# EAGLE schematic Baboi_v1.1 (EAGLE 6.4)

## Sheet 1 of 2
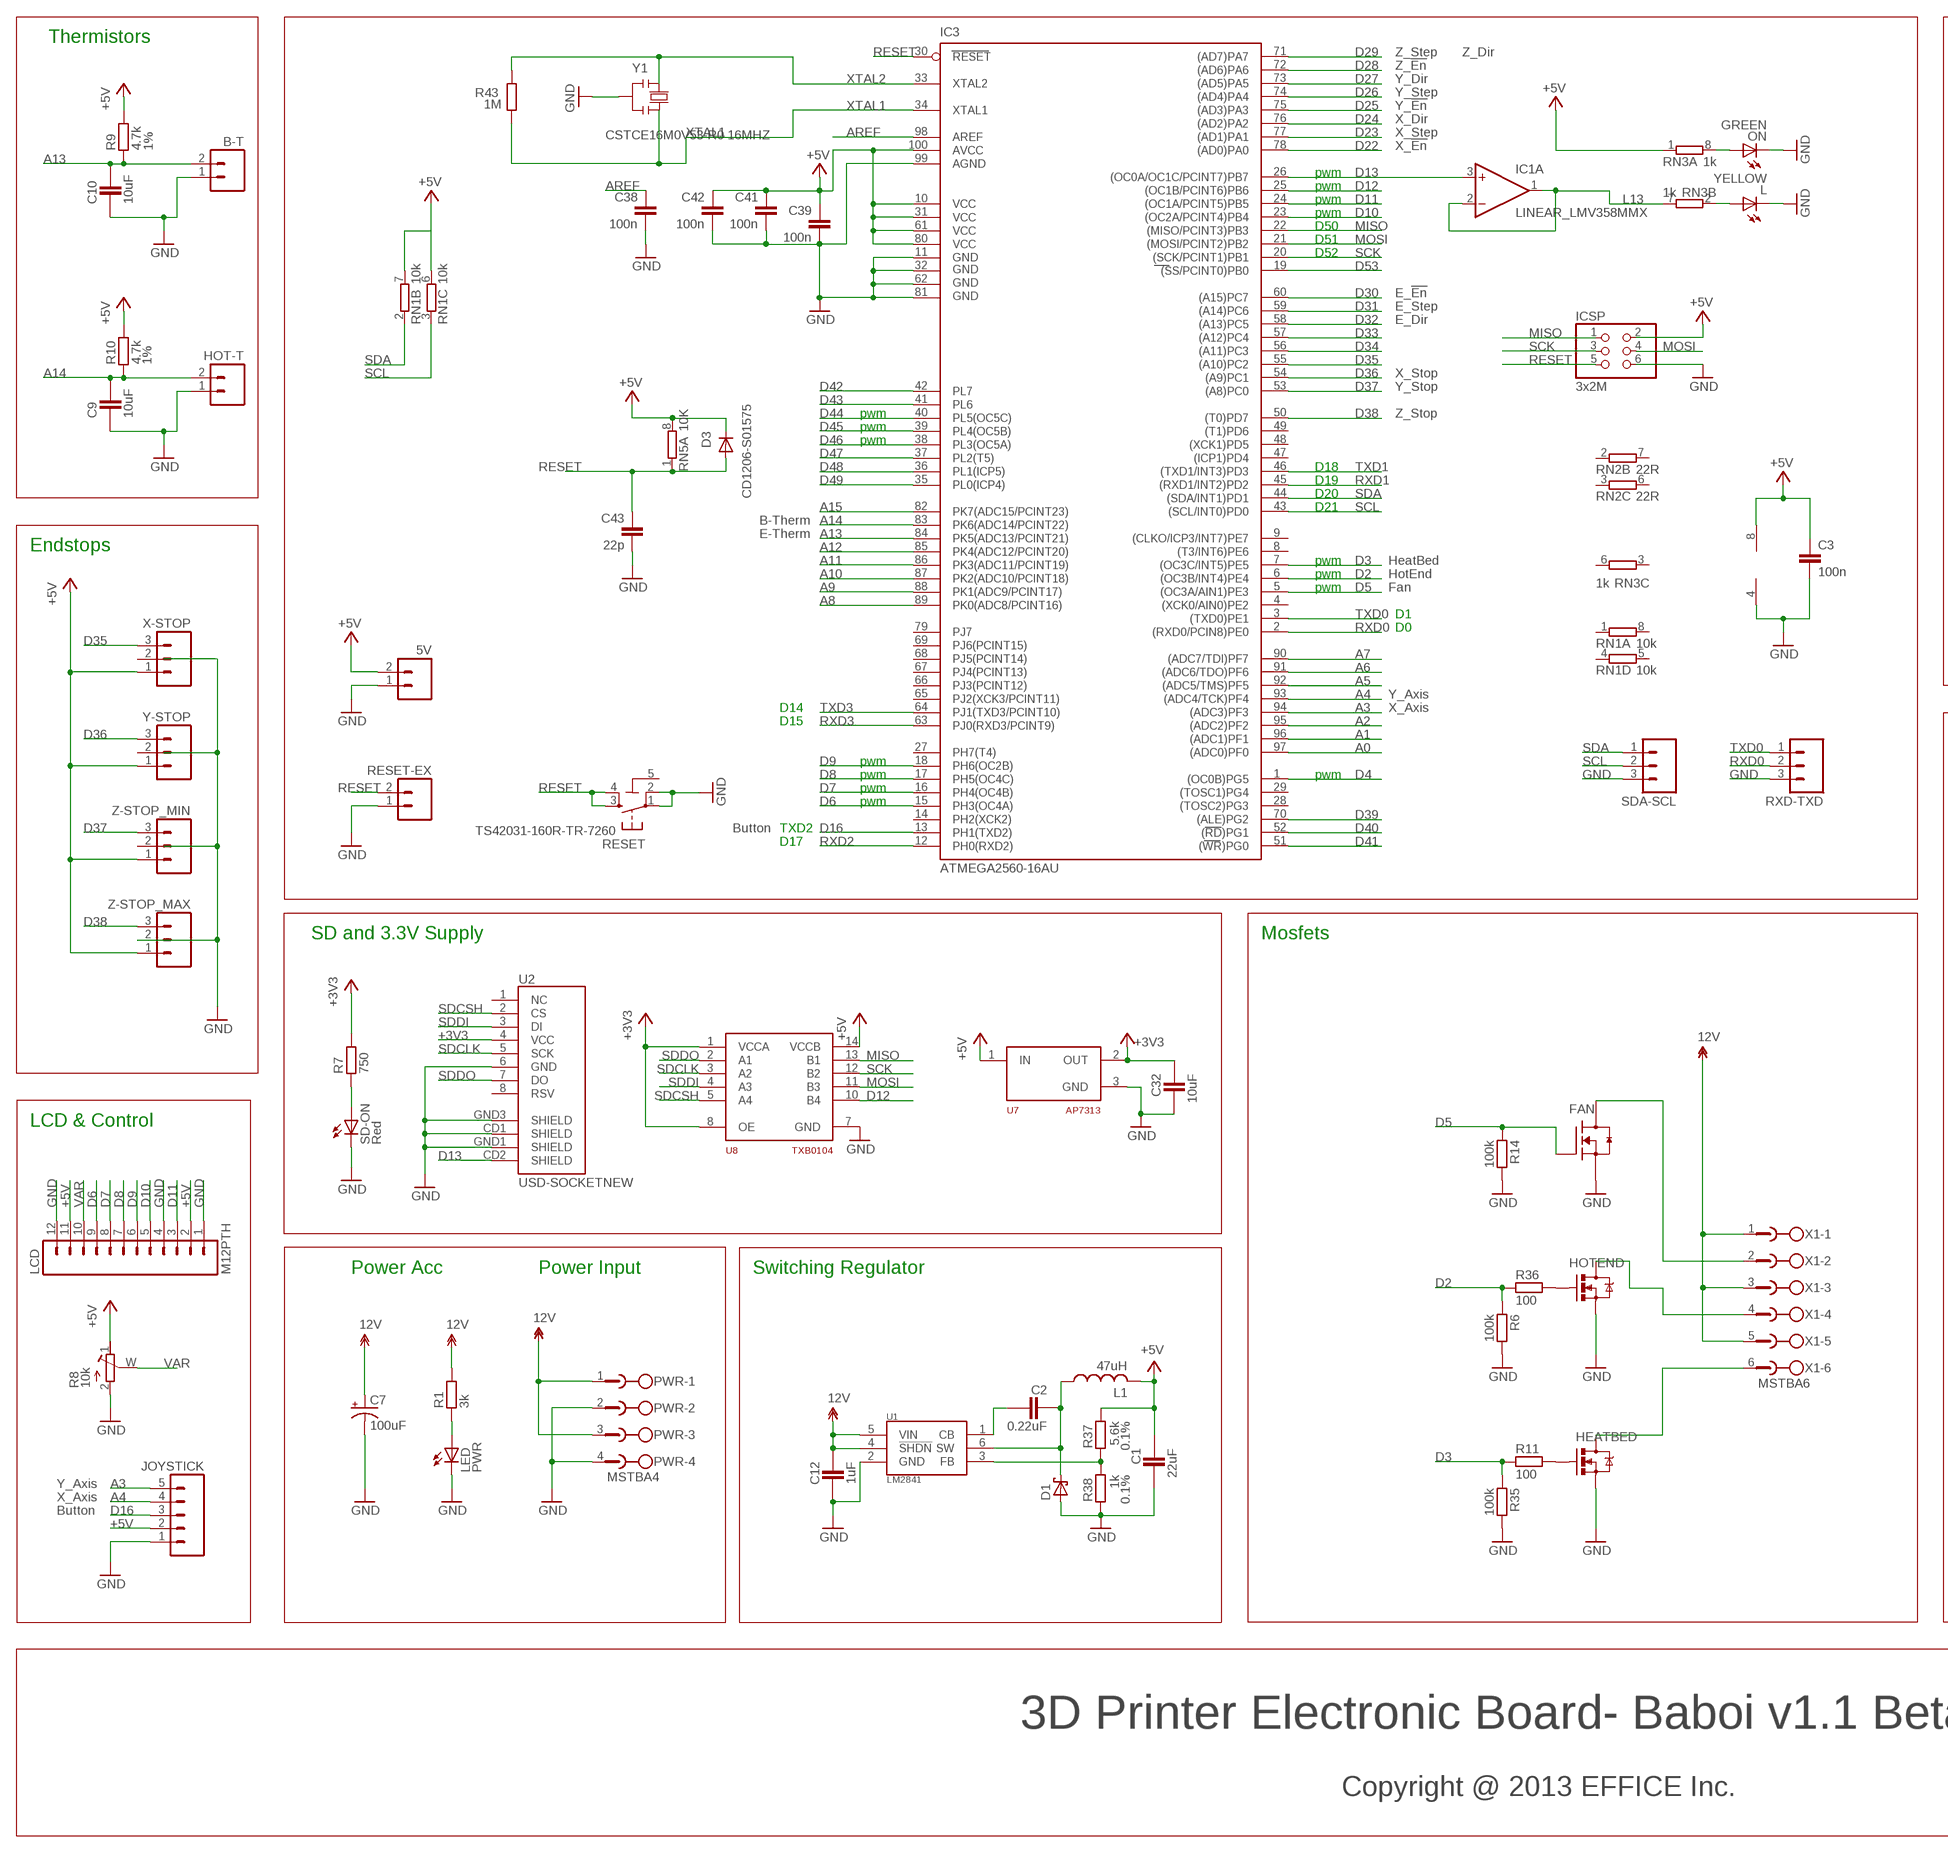
[diagram p0: schematic, sheet 1, part 1 of 2]
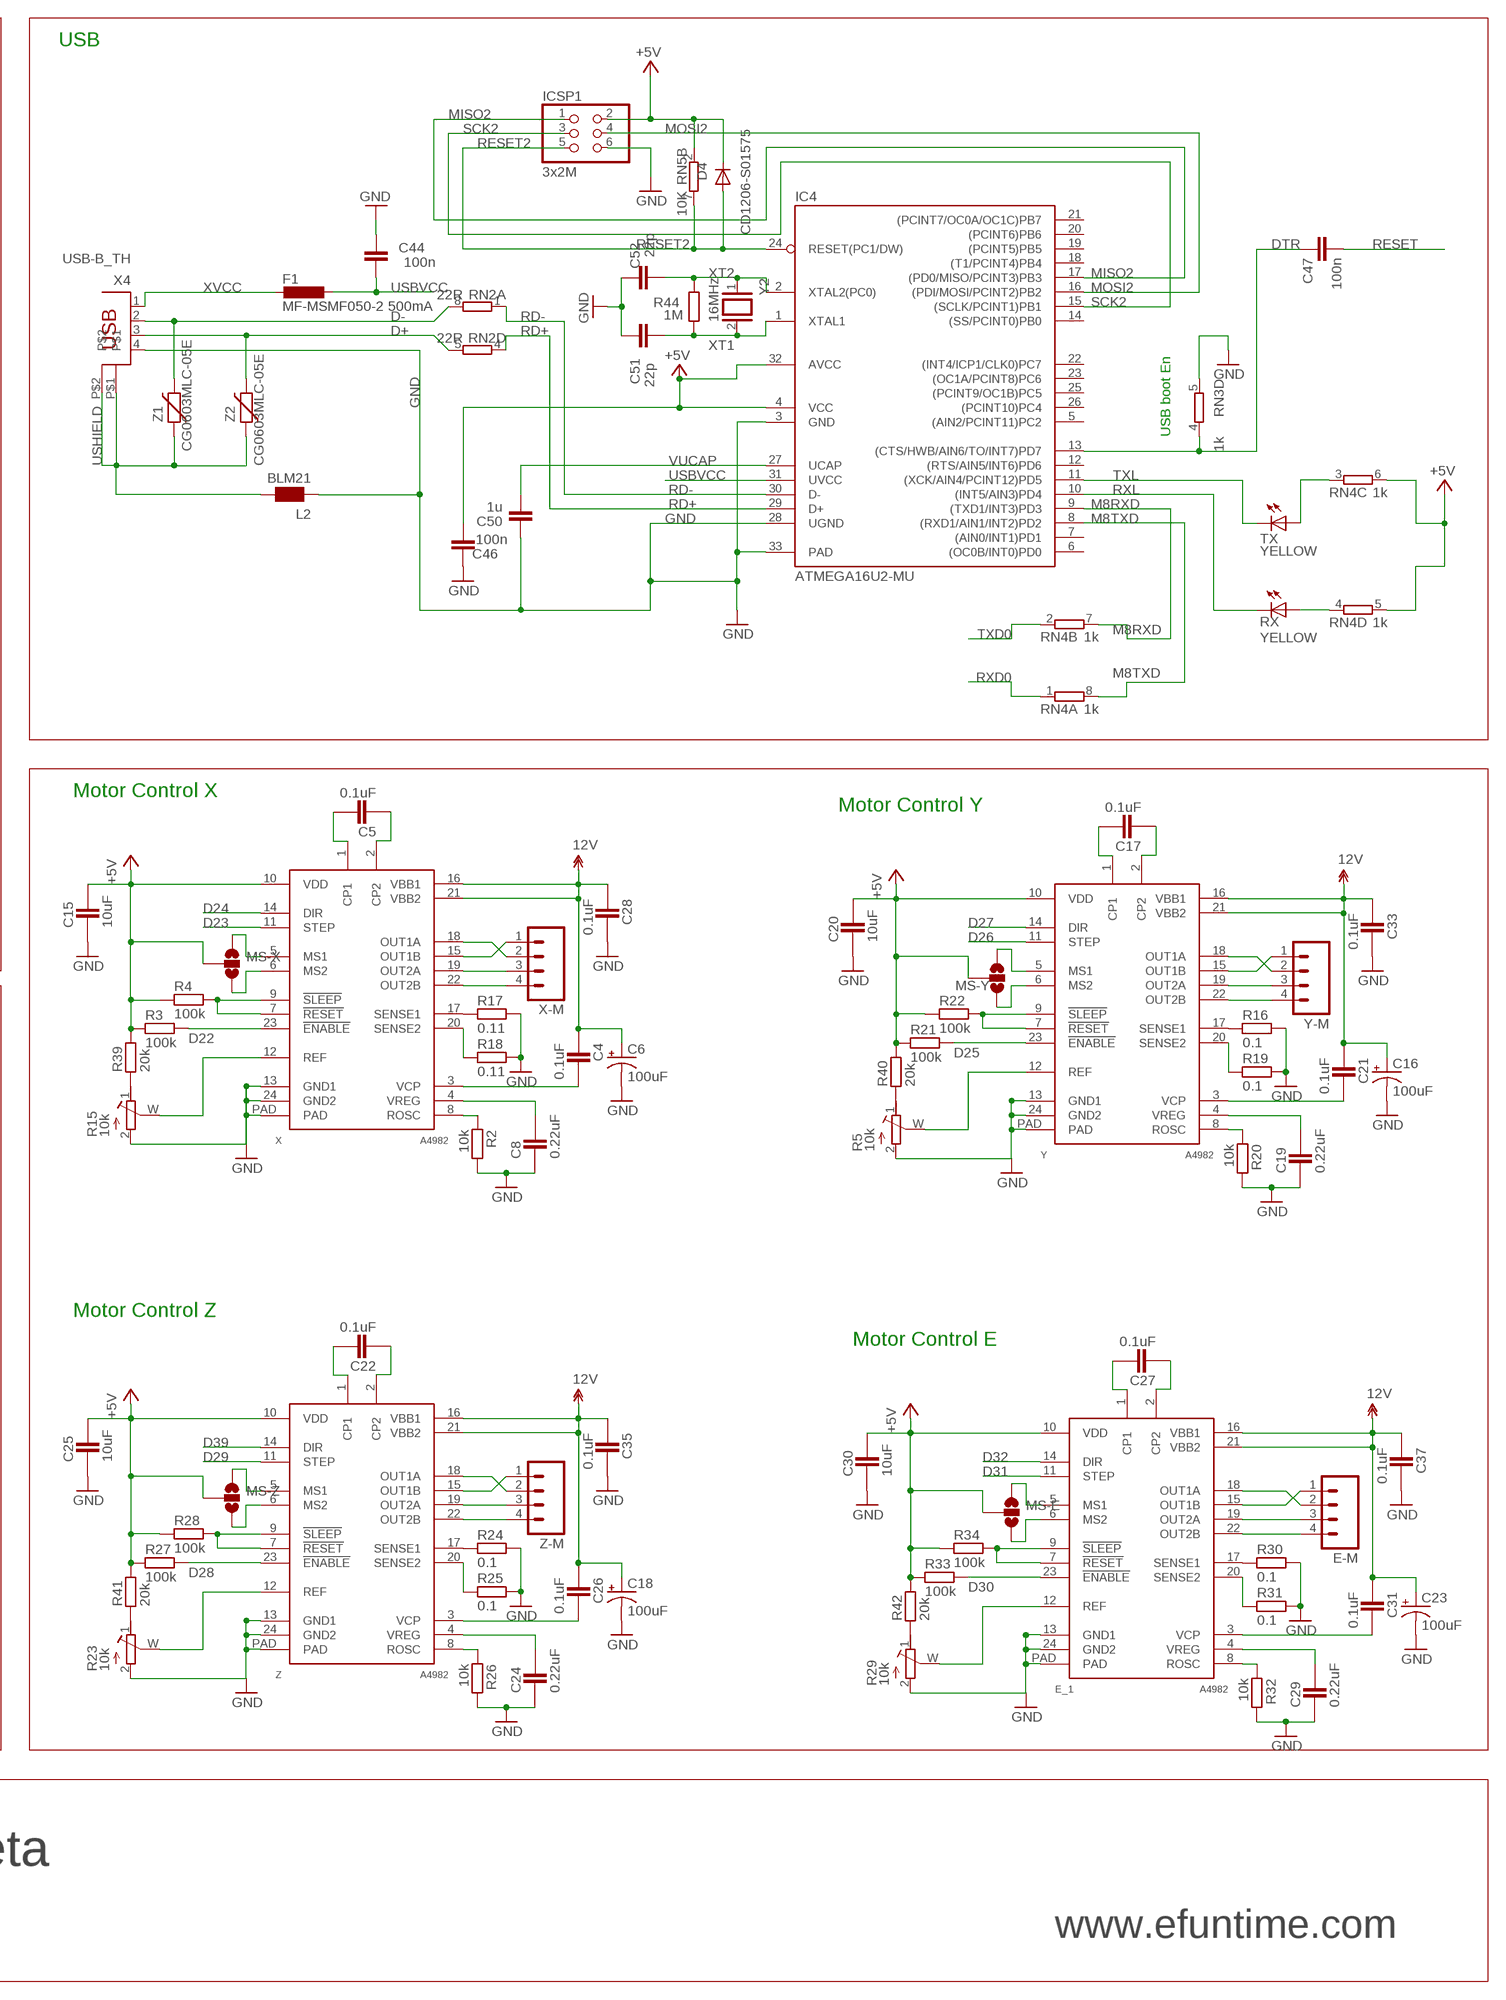
[diagram p1: schematic, sheet 1, part 2 of 2]

### Parts
5V  M02PTH  [1X02]
B-T  M02PTH  [1X02]
C1  22uF  CAPACITOR_0805  [CAPC2012X145AN]
C2  0.22uF  CAPACITOR_0805  [CAPC2012X145AN]
C3  100n  SMARTPRJ_C-EUC0603  [SMARTPRJ_C0603-ROUND]
C4  0.1uF  CAPACITOR_0805  [CAPC2012X145AN]
C5  0.1uF  CAPACITOR_0805  [CAPC2012X145AN]
C6  100uF  CPOL-USD  [PANASONIC_D]
C7  100uF  CPOL-USD  [PANASONIC_D]
C8  0.22uF  CAPACITOR_0805  [CAPC2012X145AN]
C9  10uF  CAPACITOR_0805  [CAPC2012X145AN]
C10  10uF  CAPACITOR_0805  [CAPC2012X145AN]
C12  1uF  CAPACITOR_0805  [CAPC2012X145AN]
C15  10uF  CAPACITOR_0805  [CAPC2012X145AN]
C16  100uF  CPOL-USD  [PANASONIC_D]
C17  0.1uF  CAPACITOR_0805  [CAPC2012X145AN]
C18  100uF  CPOL-USD  [PANASONIC_D]
C19  0.22uF  CAPACITOR_0805  [CAPC2012X145AN]
C20  10uF  CAPACITOR_0805  [CAPC2012X145AN]
C21  0.1uF  CAPACITOR_0805  [CAPC2012X145AN]
C22  0.1uF  CAPACITOR_0805  [CAPC2012X145AN]
C23  100uF  CPOL-USD  [PANASONIC_D]
C24  0.22uF  CAPACITOR_0805  [CAPC2012X145AN]
C25  10uF  CAPACITOR_0805  [CAPC2012X145AN]
C26  0.1uF  CAPACITOR_0805  [CAPC2012X145AN]
C27  0.1uF  CAPACITOR_0805  [CAPC2012X145AN]
C28  0.1uF  CAPACITOR_0805  [CAPC2012X145AN]
C29  0.22uF  CAPACITOR_0805  [CAPC2012X145AN]
C30  10uF  CAPACITOR_0805  [CAPC2012X145AN]
C31  0.1uF  CAPACITOR_0805  [CAPC2012X145AN]
C32  10uF  CAPACITOR_0805  [CAPC2012X145AN]
C33  0.1uF  CAPACITOR_0805  [CAPC2012X145AN]
C35  0.1uF  CAPACITOR_0805  [CAPC2012X145AN]
C37  0.1uF  CAPACITOR_0805  [CAPC2012X145AN]
C38  100n  C-EU0603-RND  [C0603-ROUND]
C39  100n  C-EU0603-RND  [C0603-ROUND]
C41  100n  C-EU0603-RND  [C0603-ROUND]
C42  100n  C-EU0603-RND  [C0603-ROUND]
C43  22p  C-EU0603-RND  [C0603-ROUND]
C44  100n  C-EU0603-RND  [C0603-ROUND]
C46  100n  C-EU0603-RND  [C0603-ROUND]
C47  100n  C-EU0603-RND  [C0603-ROUND]
C50  1u  C-EU0603-RND  [C0603-ROUND]
C51  22p  C-EU0603-RND  [C0603-ROUND]
C52  22p  C-EU0603-RND  [C0603-ROUND]
D1  SCH-DIODESMA  [SMA]
D3  CD1206-S01575  DIODE-MINIMELF  [MINIMELF]
D4  CD1206-S01575  DIODE-MINIMELF  [MINIMELF]
E-M  M04PTH  [1X04]
E_1  A4982  [TSSOP-24]
F1  MF-MSMF050-2 500mA  L-EUL1812  [L1812]
FAN  RFP30N06LE  MOSFET-NCH_SOT-23  [SOT95P280X135-3N]
HEATBED  RFP30N06LE  MOSFET-NCHANNELPTH2  [TO220V]
HOT-T  M02PTH  [1X02]
HOTEND  RFP30N06LE  MOSFET-NCHANNELPTH2  [TO220V]
IC1  LINEAR_LMV358MMX  [LINEAR_MSOP08]
IC3  ATMEGA2560-16AU  ATMEGA25602560-16AU  [TQFP100]
IC4  ATMEGA16U2-MU  [MLF32]
ICSP  3x2M  PINHD-2X3  [2X03]
ICSP1  3x2M  PINHD-2X3  [2X03]
JOYSTICK  M05PTH  [1X05]
L  YELLOW  LEDCHIP-LED0805  [CHIP-LED0805]
L1  47uH  L-US  [SDR1006]
L2  BLM21  WE-CBF_0805  [0805]
LCD  M12PTH  [1X12]
LED  PWR  LEDCHIP-LED0805  [CHIP-LED0805]
MS-E  SOLDERJUMPER_2WAYCONNECTED  [SJ_3_CONNECTED]
MS-X  SOLDERJUMPER_2WAYCONNECTED  [SJ_3_CONNECTED]
MS-Y  SOLDERJUMPER_2WAYCONNECTED  [SJ_3_CONNECTED]
MS-Z  SOLDERJUMPER_2WAYCONNECTED  [SJ_3_CONNECTED]
ON  GREEN  LEDCHIP-LED0805  [CHIP-LED0805]
PWR  MSTBA4  [MSTBA4]
R1  3k  RESISTOR_0805  [RESC2012X70N]
R2  10k  RESISTOR_0805  [RESC2012X70N]
R3  100k  RESISTOR_0805  [RESC2012X70N]
R4  100k  RESISTOR_0805  [RESC2012X70N]
R5  10k  RTRIM-ST-4EA  [RTRIM-ST4ETB]
R6  100k  RESISTOR_0805  [RESC2012X70N]
R7  750  RESISTOR_0805  [RESC2012X70N]
R8  10k  RTRIM-ST-4EA  [RTRIM-ST4ETB]
R9  4.7k  RESISTOR_0805  [RESC2012X70N]
R10  4.7k  RESISTOR_0805  [RESC2012X70N]
R11  100  RESISTOR_0805  [RESC2012X70N]
R14  100k  RESISTOR_0805  [RESC2012X70N]
R15  10k  RTRIM-ST-4EA  [RTRIM-ST4ETB]
R16  0.1  RESISTOR_0805  [RESC2012X70N]
R17  0.11  RESISTOR_0805  [RESC2012X70N]
R18  0.11  RESISTOR_0805  [RESC2012X70N]
R19  0.1  RESISTOR_0805  [RESC2012X70N]
R20  10k  RESISTOR_0805  [RESC2012X70N]
R21  100k  RESISTOR_0805  [RESC2012X70N]
R22  100k  RESISTOR_0805  [RESC2012X70N]
R23  10k  RTRIM-ST-4EA  [RTRIM-ST4ETB]
R24  0.1  RESISTOR_0805  [RESC2012X70N]
R25  0.1  RESISTOR_0805  [RESC2012X70N]
R26  10k  RESISTOR_0805  [RESC2012X70N]
R27  100k  RESISTOR_0805  [RESC2012X70N]
R28  100k  RESISTOR_0805  [RESC2012X70N]
R29  10k  RTRIM-ST-4EA  [RTRIM-ST4ETB]
R30  0.1  RESISTOR_0805  [RESC2012X70N]
R31  0.1  RESISTOR_0805  [RESC2012X70N]
R32  10k  RESISTOR_0805  [RESC2012X70N]
R33  100k  RESISTOR_0805  [RESC2012X70N]
R34  100k  RESISTOR_0805  [RESC2012X70N]
R35  100k  RESISTOR_0805  [RESC2012X70N]
R36  100  RESISTOR_0805  [RESC2012X70N]
R37  5.6k  RESISTOR_0805  [RESC2012X70N]
R38  1k  RESISTOR_0805  [RESC2012X70N]
R39  20k  RESISTOR_0805  [RESC2012X70N]
R40  20k  RESISTOR_0805  [RESC2012X70N]
R41  20k  RESISTOR_0805  [RESC2012X70N]
R42  20k  RESISTOR_0805  [RESC2012X70N]
R43  1M  R-EU_R0603  [R0603-ROUND]
R44  1M  R-EU_R0603  [R0603-ROUND]
RESET  TS42031-160R-TR-7260  TS42  [TS42]
RESET-EX  M02PTH  [1X02]
RN1  10k  RESISTOR-DIL_4R-NCAT16  [RESISTOR-DIL_CAT16]
RN2  22R  4R-NCAY16  [CAY16]
RN3  1k  4R-NCAY16  [CAY16]
RN4  1k  4R-NCAY16  [CAY16]
RN5  10K  4R-NCAT16  [CAT16]
RX  YELLOW  LEDCHIP-LED0805  [CHIP-LED0805]
RXD-TXD  M03PTH  [1X03]
SD-ON  Red  LEDCHIP-LED0805  [CHIP-LED0805]
SDA-SCL  M03PTH  [1X03]
TX  YELLOW  LEDCHIP-LED0805  [CHIP-LED0805]
U1  LM2841  [TSOT6]
U2  USD-SOCKETNEW  [MICRO-SD-SOCKET-PP]
U7  AP7313  [SOT23C]
U8  TXB0104  [TSSOP14]
X  A4982  [TSSOP-24]
X1  MSTBA6  [MSTBA6]
X4  USB-B_TH  PN61729  [PN61729]
X-M  M04PTH  [1X04]
X-STOP  M03PTH  [1X03]
Y  A4982  [TSSOP-24]
Y1  CSTCE16M0V53-R0 16MHZ  RESONATORMU  [RESONATOR]
Y2  16MHz  XTAL/S  [QS]
Y-M  M04PTH  [1X04]
Y-STOP  M03PTH  [1X03]
Z  A4982  [TSSOP-24]
Z1  CG0603MLC-05E  VARISTORCN0603  [CT/CN0603]
Z2  CG0603MLC-05E  VARISTORCN0603  [CT/CN0603]
Z-M  M04PTH  [1X04]
Z-STOP_MAX  M03PTH  [1X03]
Z-STOP_MIN  M03PTH  [1X03]

### Nets
12V [power]: C4.1 C6.+ C7.+ C12.1 C16.+ C18.+ C21.1 C23.+ C26.1 C28.1 C31.1 C33.1 C35.1 C37.1 E_1.16(VBB1) E_1.21(VBB2) PWR.1 PWR.3 R1.2 U1.4(!SHDN) U1.5(VIN) X1.1 X1.3 X1.5 X.16(VBB1) X.21(VBB2) Y.16(VBB1) Y.21(VBB2) Z.16(VBB1) Z.21(VBB2)
+3V3 [power]: C32.1 R7.2 U2.4(VCC) U7.2(OUT) U8.1(VCCA) U8.8(OE)
+5V [power]: 5V.2 C1.1 C3.1 C15.2 C20.2 C25.2 C30.2 C39.1 C41.1 C42.1 C46.1 D3.C D4.C E_1.10(VDD) IC1.8(P:V+) IC3.10(VCC) IC3.31(VCC1) IC3.61(VCC2) IC3.80(VCC3) IC3.100(AVCC) IC4.4(VCC) IC4.32(AVCC) ICSP1.2 ICSP.2 JOYSTICK.2 L1.P$2 LCD.2 LCD.11 MS-E.2 MS-X.2 MS-Y.2 MS-Z.2 R3.1 R4.1 R8.1(A) R9.2 R10.2 R21.1 R22.1 R27.1 R28.1 R33.1 R34.1 R37.1 R39.2 R40.2 R41.2 R42.2 RN1.6 RN1.7 RN3.1 RN4.5 RN4.6 RN5.2 RN5.8 U7.1(IN) U8.14(VCCB) X-STOP.1 X.10(VDD) Y-STOP.1 Y.10(VDD) Z-STOP_MAX.1 Z-STOP_MIN.1 Z.10(VDD)
A0: IC3.97((ADC0)PF0)
A1: IC3.96((ADC1)PF1)
A2: IC3.95((ADC2)PF2)
A3: IC3.94((ADC3)PF3) JOYSTICK.5
A4: IC3.93((ADC4/TCK)PF4) JOYSTICK.4
A5: IC3.92((ADC5/TMS)PF5)
A6: IC3.91((ADC6/TDO)PF6)
A7: IC3.90((ADC7/TDI)PF7)
A8: IC3.89(PK0(ADC8/PCINT16))
A9: IC3.88(PK1(ADC9/PCINT17))
A10: IC3.87(PK2(ADC10/PCINT18))
A11: IC3.86(PK3(ADC11/PCINT19))
A12: IC3.85(PK4(ADC12/PCINT20))
A13: B-T.2 C10.2 IC3.84(PK5(ADC13/PCINT21)) R9.1
A14: C9.2 HOT-T.2 IC3.83(PK6(ADC14/PCINT22)) R10.1
A15: IC3.82(PK7(ADC15/PCINT23))
AREF: C38.1 IC3.98(AREF)
D2: IC3.6((OC3B/INT4)PE4) R6.1 R36.1
D3: IC3.7((OC3C/INT5)PE5) R11.1 R35.1
D4: IC3.1((OC0B)PG5)
D5: FAN.1(G) IC3.5((OC3A/AIN1)PE3) R14.1
D6: IC3.15(PH3(OC4A)) LCD.9
D7: IC3.16(PH4(OC4B)) LCD.8
D8: IC3.17(PH5(OC4C)) LCD.7
D9: IC3.18(PH6(OC2B)) LCD.6
D10: IC3.23((OC2A/PCINT4)PB4) LCD.5
D11: IC3.24((OC1A/PCINT5)PB5) LCD.3
D12: IC3.25((OC1B/PCINT6)PB6) U8.10(B4)
D13: IC1.3(A:+IN) IC3.26((OC0A/OC1C/PCINT7)PB7) U2.CD2(SHIELD)
D16: IC3.13(PH1(TXD2)) JOYSTICK.3
D22: IC3.78((AD0)PA0) R3.2 X.23(!ENABLE)
D23: IC3.77((AD1)PA1) X.11(STEP)
D24: IC3.76((AD2)PA2) X.14(DIR)
D25: IC3.75((AD3)PA3) R21.2 Y.23(!ENABLE)
D26: IC3.74((AD4)PA4) Y.11(STEP)
D27: IC3.73((AD5)PA5) Y.14(DIR)
D28: IC3.72((AD6)PA6) R27.2 Z.23(!ENABLE)
D29: IC3.71((AD7)PA7) Z.11(STEP)
D30: E_1.23(!ENABLE) IC3.60((A15)PC7) R33.2
D31: E_1.11(STEP) IC3.59((A14)PC6)
D32: E_1.14(DIR) IC3.58((A13)PC5)
D33: IC3.57((A12)PC4)
D34: IC3.56((A11)PC3)
D35: IC3.55((A10)PC2) X-STOP.3
D36: IC3.54((A9)PC1) Y-STOP.3
D37: IC3.53((A8)PC0) Z-STOP_MIN.3
D38: IC3.50((T0)PD7) Z-STOP_MAX.3
D39: IC3.70((ALE)PG2) Z.14(DIR)
D40: IC3.52((RD)PG1)
D41: IC3.51((WR)PG0)
D42: IC3.42(PL7)
D43: IC3.41(PL6)
D44: IC3.40(PL5(OC5C))
D45: IC3.39(PL4(OC5B))
D46: IC3.38(PL3(OC5A))
D47: IC3.37(PL2(T5))
D48: IC3.36(PL1(ICP5))
D49: IC3.35(PL0(ICP4))
D53: IC3.19((SS/PCINT0)PB0)
D+: RN2.5 X4.3 Z2.2
D-: RN2.8 X4.2 Z1.2
DTR: C47.1 IC4.13((CTS/HWB/AIN6/TO/INT7)PD7) RN3.4
FAN: FAN.3(D) X1.2
GND [power]: 5V.1 B-T.1 C1.2 C3.2 C6.- C7.- C8.1 C9.1 C10.1 C12.2 C15.1 C16.- C18.- C19.1 C20.1 C23.- C24.1 C25.1 C28.2 C29.1 C30.1 C32.2 C33.2 C35.2 C37.2 C38.2 C39.2 C41.2 C42.2 C43.2 C44.2 C46.2 C50.2 C51.2 C52.2 D1.A E_1.13(GND1) E_1.24(GND2) E_1.PAD FAN.2(S) HEATBED.3(S) HOT-T.1 HOTEND.3(S) IC1.4(P:V-) IC3.11(GND) IC3.32(GND1) IC3.62(GND2) IC3.81(GND3) IC3.99(AGND) IC4.3(GND) IC4.28(UGND) IC4.33(PAD) ICSP1.6 ICSP.6 JOYSTICK.1 L2.1 L.C LCD.1 LCD.4 LCD.12 LED.C ON.C PWR.2 PWR.4 R2.2 R5.2(E) R6.2 R8.2(E) R14.2 R15.2(E) R16.2 R17.2 R18.2 R19.2 R20.2 R23.2(E) R24.2 R25.2 R26.2 R29.2(E) R30.2 R31.2 R32.2 R35.2 R38.2 RESET-EX.1 RESET.1 RESET.2 RN3.5 RXD-TXD.3 SD-ON.C SDA-SCL.3 U1.2(GND) U2.6(GND) U2.CD1(SHIELD) U2.GND1(SHIELD) U2.GND3(SHIELD) U7.3(GND) U8.7(GND) X4.4 X.13(GND1) X.24(GND2) X.PAD Y1.2 Y.13(GND1) Y.24(GND2) Y.PAD Z-STOP_MAX.2 Z.13(GND1) Z.24(GND2) Z.PAD
HOTBED-GND [power]: HEATBED.2(D) X1.6
HOTEND-GND [power]: HOTEND.2(D) X1.4
L13: IC1.1(A:OUT) IC1.2(A:-IN) RN3.7
M8RXD: IC4.9((TXD1/INT3)PD3) RN4.7
M8TXD: IC4.8((RXD1/AIN1/INT2)PD2) RN4.8
MISO: IC3.22((MISO/PCINT3)PB3) ICSP.1 U8.13(B1)
MISO2: IC4.17((PD0/MISO/PCINT3)PB3) ICSP1.1
MOSI: IC3.21((MOSI/PCINT2)PB2) ICSP.4 U8.11(B3)
MOSI2: IC4.16((PDI/MOSI/PCINT2)PB2) ICSP1.4
N$1: LED.A R1.1
N$2: R7.1 SD-ON.A
N$3: X-M.3 X.19(OUT2A)
N$4: X-M.4 X.22(OUT2B)
N$5: Y-M.3 Y.19(OUT2A)
N$6: Y-M.4 Y.22(OUT2B)
N$7: HEATBED.1(G) R11.2
N$8: R5.1(A) R40.1
N$9: Z-M.3 Z.19(OUT2A)
N$10: X-M.2 X.18(OUT1A)
N$11: C5.2 X.1(CP1)
N$12: C5.1 X.2(CP2)
N$13: R2.1 X.8(ROSC)
N$14: R17.1 X.17(SENSE1)
N$15: R18.1 X.20(SENSE2)
N$16: C4.2 X.3(VCP)
N$17: X-M.1 X.15(OUT1B)
N$18: R15.W(S) X.12(REF)
N$19: C8.2 X.4(VREG)
N$20: Z-M.4 Z.22(OUT2B)
N$21: R4.2 X.7(!RESET) X.9(!SLEEP)
N$22: R37.2 R38.1 U1.3(FB)
N$23: E-M.3 E_1.19(OUT2A)
N$24: E-M.4 E_1.22(OUT2B)
N$26: Y-M.1 Y.15(OUT1B)
N$27: MS-X.1 X.5(MS1)
N$28: MS-X.3 X.6(MS2)
N$29: C17.2 Y.1(CP1)
N$30: C17.1 Y.2(CP2)
N$31: Y-M.2 Y.18(OUT1A)
N$32: R19.1 Y.20(SENSE2)
N$33: R5.W(S) Y.12(REF)
N$34: R20.1 Y.8(ROSC)
N$35: C19.2 Y.4(VREG)
N$36: R22.2 Y.7(!RESET) Y.9(!SLEEP)
N$37: C21.2 Y.3(VCP)
N$38: R16.1 Y.17(SENSE1)
N$39: Z-M.1 Z.15(OUT1B)
N$40: Z-M.2 Z.18(OUT1A)
N$42: MS-Y.1 Y.5(MS1)
N$43: MS-Y.3 Y.6(MS2)
N$44: C22.2 Z.1(CP1)
N$45: C22.1 Z.2(CP2)
N$46: R24.1 Z.17(SENSE1)
N$47: R25.1 Z.20(SENSE2)
N$48: R23.W(S) Z.12(REF)
N$49: R26.1 Z.8(ROSC)
N$50: C24.2 Z.4(VREG)
N$51: R28.2 Z.7(!RESET) Z.9(!SLEEP)
N$52: C26.2 Z.3(VCP)
N$54: E-M.1 E_1.15(OUT1B)
N$55: E-M.2 E_1.18(OUT1A)
N$56: ICSP.5
N$57: MS-Z.1 Z.5(MS1)
N$58: MS-Z.3 Z.6(MS2)
N$59: C27.2 E_1.1(CP1)
N$60: C27.1 E_1.2(CP2)
N$61: E_1.17(SENSE1) R30.1
N$62: E_1.20(SENSE2) R31.1
N$63: E_1.12(REF) R29.W(S)
N$64: E_1.8(ROSC) R32.1
N$65: C29.2 E_1.4(VREG)
N$66: E_1.7(!RESET) E_1.9(!SLEEP) R34.2
N$67: C31.2 E_1.3(VCP)
N$68: RESET.3 RESET.4
N$69: R15.1(A) R39.1
N$70: ON.A RN3.8
N$71: HOTEND.1(G) R36.2
N$72: E_1.5(MS1) MS-E.1
N$73: E_1.6(MS2) MS-E.3
N$74: R29.1(A) R42.1
N$75: C2.1 D1.C L1.P$1 U1.6(SW)
N$76: RN4.4 RX.A
N$77: C2.2 U1.1(CB)
N$78: R23.1(A) R41.1
N$79: RN4.3 TX.A
N$80: L.A RN3.2
N$83: RESET-EX.2
N$84: C43.1 D3.A RN5.1
RD+: IC4.29(D+) RN2.4
RD-: IC4.30(D-) RN2.1
RESET: C47.2 IC3.30(RESET)
RESET2: D4.A IC4.24(RESET(PC1/DW)) ICSP1.5 RN5.7
RXD0: IC3.2((RXD0/PCIN8)PE0) RN4.1 RXD-TXD.2
RXD1: IC3.45((RXD1/INT2)PD2)
RXD2: IC3.12(PH0(RXD2))
RXD3: IC3.63(PJ0(RXD3/PCINT9))
RXL: IC4.10((INT5/AIN3)PD4) RX.C
SCK: IC3.20((SCK/PCINT1)PB1) ICSP.3 U8.12(B2)
SCK2: IC4.15((SCLK/PCINT1)PB1) ICSP1.3
SCL: IC3.43((SCL/INT0)PD0) RN1.3 SDA-SCL.2
SDA: IC3.44((SDA/INT1)PD1) RN1.2 SDA-SCL.1
SDCLK: U2.5(SCK) U8.3(A2)
SDCSH: U2.2(CS) U8.5(A4)
SDDI: U2.3(DI) U8.4(A3)
SDDO: U2.7(DO) U8.2(A1)
TXD0: IC3.3((TXD0)PE1) RN4.2 RXD-TXD.1
TXD1: IC3.46((TXD1/INT3)PD3)
TXD3: IC3.64(PJ1(TXD3/PCINT10))
TXL: IC4.11((XCK/AIN4/PCINT12)PD5) TX.C
USBVCC [power usb]: C44.1 F1.1 IC4.31(UVCC)
USHIELD [gnd]: L2.2 X4.P$1 X4.P$2 Z1.1 Z2.1
VAR: LCD.10 R8.W(S)
VUCAP: C50.1 IC4.27(UCAP)
XT1: C51.1 IC4.1(XTAL1) R44.1 Y2.2
XT2: C52.1 IC4.2(XTAL2(PC0)) R44.2 Y2.1
XTAL1: IC3.34(XTAL1) R43.1 Y1.3
XTAL2: IC3.33(XTAL2) R43.2 Y1.1
XVCC [power usb]: F1.2 X4.1
Unconnected: IC1.5(B:+IN) IC1.6(B:-IN) IC1.7(B:OUT) IC3.4((XCK0/AIN0)PE2) IC3.8((T3/INT6)PE6) IC3.9((CLKO/ICP3/INT7)PE7) IC3.14(PH2(XCK2)) IC3.27(PH7(T4)) IC3.28((TOSC2)PG3) IC3.29((TOSC1)PG4) IC3.47((ICP1)PD4) IC3.48((XCK1)PD5) IC3.49((T1)PD6) IC3.65(PJ2(XCK3/PCINT11)) IC3.66(PJ3(PCINT12)) IC3.67(PJ4(PCINT13)) IC3.68(PJ5(PCINT14)) IC3.69(PJ6(PCINT15)) IC3.79(PJ7) IC4.5((AIN2/PCINT11)PC2) IC4.6((OC0B/INT0)PD0) IC4.7((AIN0/INT1)PD1) IC4.12((RTS/AIN5/INT6)PD6) IC4.14((SS/PCINT0)PB0) IC4.18((T1/PCINT4)PB4) IC4.19((PCINT5)PB5) IC4.20((PCINT6)PB6) IC4.21((PCINT7/OC0A/OC1C)PB7) IC4.22((INT4/ICP1/CLK0)PC7) IC4.23((OC1A/PCINT8)PC6) IC4.25((PCINT9/OC1B)PC5) IC4.26((PCINT10)PC4) RN1.1 RN1.4 RN1.5 RN1.8 RN2.2 RN2.3 RN2.6 RN2.7 RN3.3 RN3.6 RN5.3 RN5.4 RN5.5 RN5.6 U2.1(NC) U2.8(RSV) X-STOP.2 Y-STOP.2 Z-STOP_MIN.2

### Notes on the sheet
- Thermistors
- USB
- Z_Step | Z_Dir
- Z_!En
- Y_Dir
- Y_Step
- Y_!En
- X_Dir
- X_Step
- X_!En
- pwm
- pwm
- pwm
- pwm
- D50
- D51
- D52
- E_!En
- E_Step
- E_Dir
- RESET
- X_Stop
- Y_Stop
- USB boot En
- pwm | Z_Stop
- pwm
- pwm
- RESET | D18
- D19
- D20
- D21
- B-Therm
- E-Therm
- Endstops
- pwm | HeatBed
- pwm | HotEnd
- pwm | Fan
- D1
- D0
- Y_Axis
- D14 | X_Axis
- D15
- Motor Control X
- Motor Control Y
- pwm
- pwm | pwm
- RESET | RESET | pwm
- pwm
- Button | TXD2
- D17
- SD and 3.3V Supply | Mosfets
- LCD & Control
- Motor Control Z
- Motor Control E
- Power Acc | Power Input | Switching Regulator
- Y_Axis
- X_Axis
- Button
- 3D Printer Electronic Board- Baboi v1.1 Beta
- Copyright @ 2013 EFFICE Inc. | www.efuntime.com

## Sheet 2 of 2

## Power pins joined to a net without a drawn wire
5-GND: RESET.5(5-GND)

## Library data of the parts
5V B-T HOT-T RESET-EX = SparkFun:M02: Header 2 Standard 2-pin 0.1" header. Use with straight break away headers (SKU : PRT-00116), right angle break away headers (PRT-00553), swiss pins (PRT-00743), machine pins (PRT-00117), and female headers (PRT-00115). Molex polarized connector foot print use with SKU : PRT-08233 with associated crimp pins and housings.
C1 C2 C4 C5 C8-C10 C12 C15 C17 C19-C22 C24-C33 C35 C37 = ipc-7351-capacitor:CAPACITOR_
C3 = Arduino_MEGA_2560-Rev3:SMARTPRJ_C-EU: CAPACITOR, European symbol
C6 C7 C16 C18 C23 = rcl:CPOL-US: POLARIZED CAPACITOR, American symbol
C38 C39 C41-C44 C46 C47 C50-C52 = SmartPrj:C-EU: CAPACITOR, European symbol
D1 = printrbot:SCH-DIODE: Schottky Diodes Source: Fairchild .. BAT54.pdf
D3 D4 = diode:DIODE-: DIODE
E-M X-M Y-M Z-M = SparkFun:M04: Header 4 Standard 4-pin 0.1" header. Use with straight break away headers (SKU : PRT-00116), right angle break away headers (PRT-00553), swiss pins (PRT-00743), machine pins (PRT-00117), and female headers (PRT-00115). Molex polarized connector foot print use with SKU : PRT-08231 with associated crimp pins and housings. 1MM SMD Version SKU: PRT-10208
E_1 X Y Z = printrbot:A4982
F1 = rcl:L-EU: INDUCTOR, European symbol
FAN = ipc-7351-transistor:MOSFET-NCH_
HEATBED HOTEND = SparkFun:MOSFET-NCHANNEL
IC1 = Arduino_MEGA_2560-Rev3:LINEAR_LMV358?*: Dual General Purpose, Low Voltage, Rail-to-Rail Output Operational Amplifiers Source: http://www.national.com/mpf/LM/LMV321.html http://www.national.com/dt/lmv_qual.pdf
IC3 = SmartPrj:ATMEGA2560: MICROCONTROLLER 64/128/256 Kbytes FLASH 4 Kbytes EEPROM 8 Kbytes SRAM 86 General Purpose I/O pins 12-channels16-bit PWM 4 x Serial USARTs 16-channels 10-bit A/D
IC4 = SmartPrj:ATMEGA16U2-
ICSP ICSP1 = SmartPrj:PINHD-2X3: PIN HEADER
JOYSTICK = SparkFun:M05: Header 5 Standard 5-pin 0.1" header. Use with straight break away headers (SKU : PRT-00116), right angle break away headers (PRT-00553), swiss pins (PRT-00743), machine pins (PRT-00117), and female headers (PRT-00115). Molex polarized connector foot print use with SKU : PRT-08230 with associated crimp pins and housings.
L LED ON RX SD-ON TX = led:LED: LED OSRAM: - CHIPLED LG R971, LG N971, LY N971, LG Q971, LY Q971, LO R971, LY R971 LH N974, LH R974 LS Q976, LO Q976, LY Q976 LO Q996 - Hyper CHIPLED LW Q18S LB Q993, LB Q99A, LB R99A - SideLED LS A670, LO A670, LY A670, LG A670, LP A670 LB A673, LV A673, LT A673, LW A673 LH A674 LY A675 LS A676, LA A676, LO A676, LY A676, LW A676 LS A679, LY A679, LG A679 - Hyper Micro SIDELED® LS Y876, LA Y876, LO Y876, LY Y876 LT Y87S - SmartLED LW L88C, LW L88S LB L89C, LB L89S, LG L890 LS L89K, LO L89K, LY L89K LS L896, LA L896, LO L896, LY L896 - TOPLED LS T670, LO T670, LY T670, LG T670, LP T670 LSG T670, LSP T670, LSY T670, LOP T670, LYG T670 LG T671, LOG T671, LSG T671 LB T673, LV T673, LT T673, LW T673 LH T674 LS T676, LA T676, LO T676, LY T676, LB T676, LH T676, LSB T676, LW T676 LB T67C, LV T67C, LT T67C, LS T67K, LO T67K, LY T67K, LW E67C LS E67B, LA E67B, LO E67B, LY E67B, LB E67C, LV E67C, LT E67C LW T67C LS T679, LY T679, LG T679 LS T770, LO T770, LY T770, LG T770, LP T770 LB T773, LV T773, LT T773, LW T773 LH T774 LS E675, LA E675, LY E675, LS T675 LS T776, LA T776, LO T776, LY T776, LB T776 LHGB T686 LT T68C, LB T68C - Hyper Mini TOPLED® LB M676 - Mini TOPLED Santana® LG M470 LS M47K, LO M47K, LY M47K Source: http://www.osram.convergy.de LUXEON: - LUMILED® LXK2-PW12-R00, LXK2-PW12-S00, LXK2-PW14-U00, LXK2-PW14-V00 LXK2-PM12-R00, LXK2-PM12-S00, LXK2-PM14-U00 LXK2-PE12-Q00, LXK2-PE12-R00, LXK2-PE12-S00, LXK2-PE14-T00, LXK2-PE14-U00 LXK2-PB12-K00, LXK2-PB12-L00, LXK2-PB12-M00, LXK2-PB14-N00, LXK2-PB14-P00, LXK2-PB14-Q00 LXK2-PR12-L00, LXK2-PR12-M00, LXK2-PR14-Q00, LXK2-PR14-R00 LXK2-PD12-Q00, LXK2-PD12-R00, LXK2-PD12-S00 LXK2-PH12-R00, LXK2-PH12-S00 LXK2-PL12-P00, LXK2-PL12-Q00, LXK2-PL12-R00 Source: www.luxeon.com KINGBRIGHT: KA-3528ASYC Source: www.kingbright.com
L1 = printrbot:L-US
L2 = wuerth-elektronik:WE-CBF: SMD EMI Suppression Ferrite Beads - excellent anti-EMI properties - low DCR - impedances till 3000 ohms - rated current up to 6 A
LCD = SparkFun:M12: Header 12 Standard 12-pin 0.1" header. Use with straight break away headers (SKU : PRT-00116), right angle break away headers (PRT-00553), swiss pins (PRT-00743), machine pins (PRT-00117), and female headers (PRT-00115).
MS-E MS-X MS-Y MS-Z = printrbot:SOLDERJUMPER_2WAY: Solder Jumper 2 way solder jumper
PWR = con-phoenix-508:MSTBA4: PHOENIX; MF: FARNELL; MPN: 1757268; OC_FARNELL: 3705195; OC_NEWARK: 71C4163
R1-R4 R6 R7 R11 R14 R16-R22 R24-R28 R30-R36 R39-R42 = ipc-7351-resistor:RESISTOR_
R5 R8 R15 R23 R29 = printrbot:RTRIM-ST-4EA
R9 R10 = ipc-7351-resistor:RESISTOR_; TOLERANCE: 1%
R37 R38 = ipc-7351-resistor:RESISTOR_; TOLERANCE: 0.1%
R43 R44 = SmartPrj:R-EU_: RESISTOR, European symbol
RESET = SmartPrj:TS42: TS42 Dongnan Electronics Tact switch VDC 12V - 50mA
RN1 = Arduino_MEGA_2560-Rev3:RESISTOR-DIL_4R-N: Array Chip Resistor Source: RS Component / Phycomp
RN2-RN5 = resistor-dil:4R-N: Array Chip Resistor Source: RS Component / Phycomp
RXD-TXD SDA-SCL X-STOP Y-STOP Z-STOP_MAX Z-STOP_MIN = SparkFun:M03: Header 3 Standard 3-pin 0.1" header. Use with straight break away headers (SKU : PRT-00116), right angle break away headers (PRT-00553), swiss pins (PRT-00743), machine pins (PRT-00117), and female headers (PRT-00115). Molex polarized connector foot print use with SKU : PRT-08232 with associated crimp pins and housings.
U1 = printrbot:LM2841
U2 = SparkFun:USD-SOCKET: microSD Socket Push-push type uSD socket. Schematic element and footprint production proven. Spark Fun Electronics SKU : PRT-00127. tDoc lines correctly indicate media card edge positions when inserting (unlocked, locked, depressed).
U7 = printrbot:AP7313
U8 = printrbot:TXB0104
X1 = con-phoenix-508:MSTBA6: PHOENIX; MF: FARNELL; MPN: 1757284; OC_FARNELL: 3705213; OC_NEWARK: 71C4165
X4 = SmartPrj:PN61729: BERG USB connector
Y1 = SmartPrj:RESONATOR
Y2 = SmartPrj:XTAL/S: CRYSTAL
Z1 Z2 = varistor:VARISTOR: VARISTOR

## Net classes
2 gnd: width 0.305 mm, drill 0.406 mm, clearance 0.203 mm
3 power usb: width 0.508 mm, drill 0.406 mm, clearance 0.203 mm